# EAGLE schematic RAC-radio (EAGLE 9.5.2)
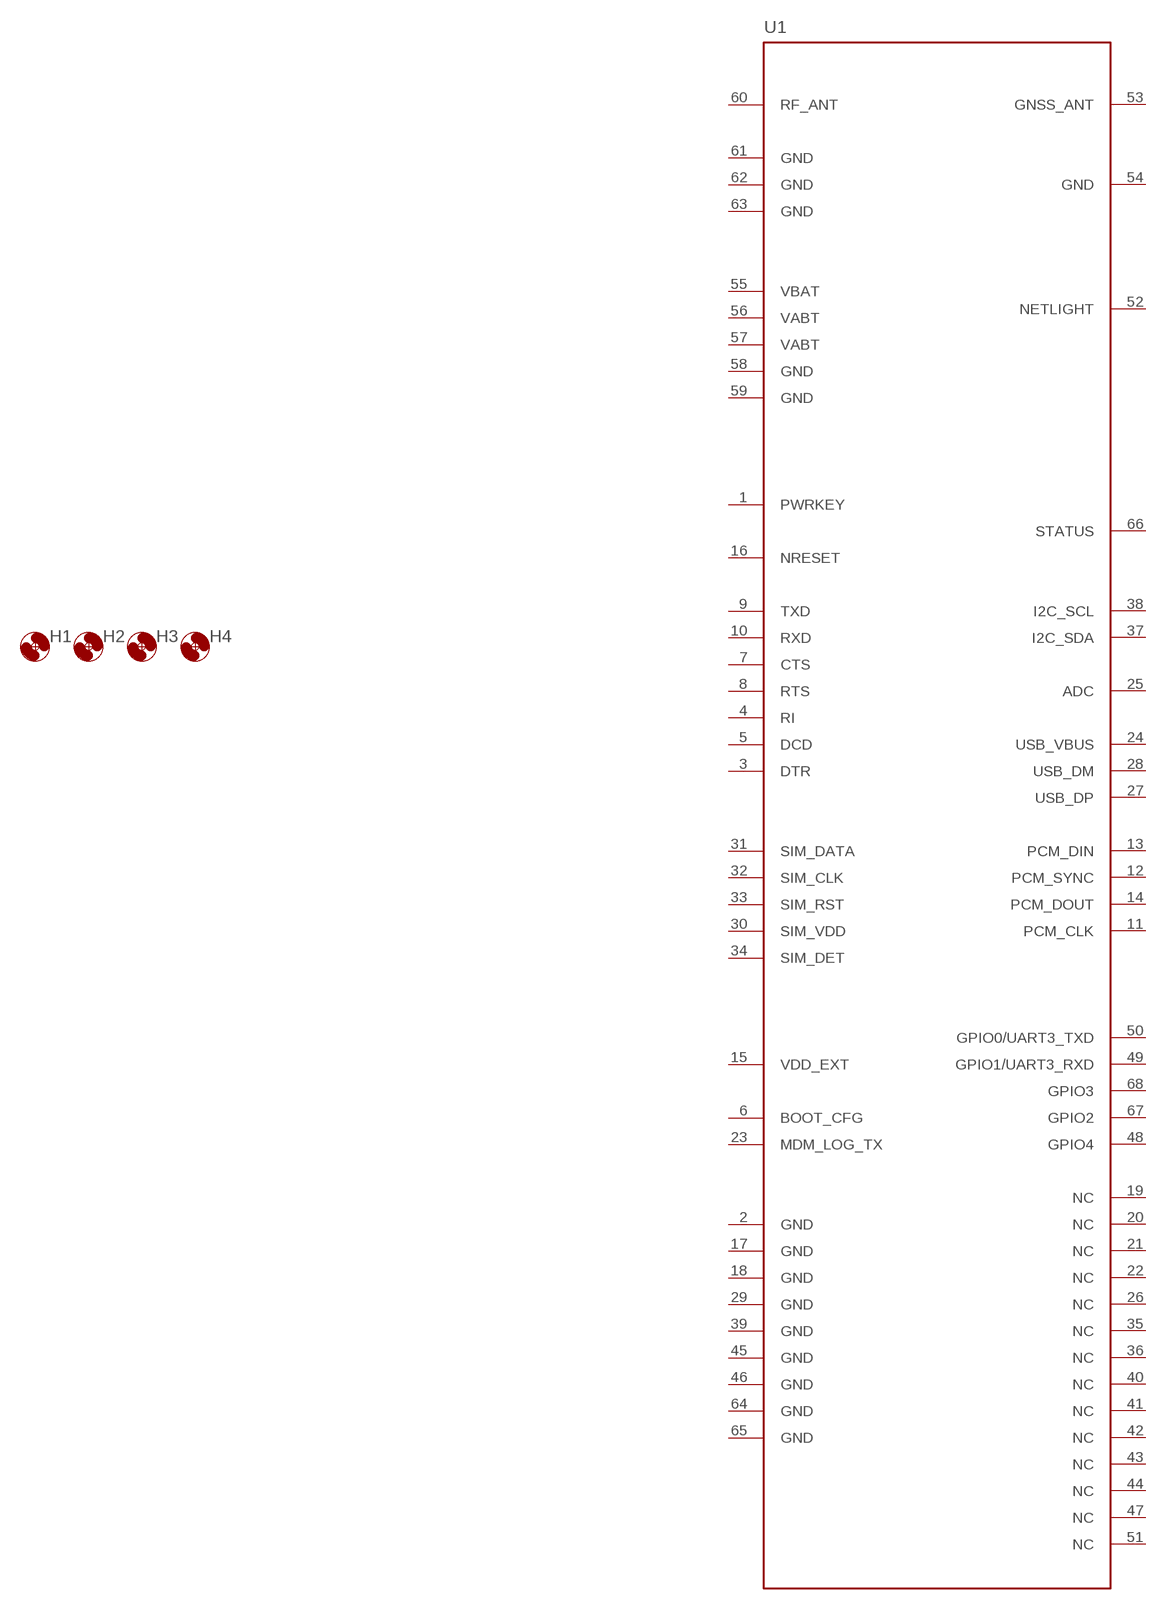
[diagram p0: schematic, sheet 1]

## Parts
H1  MOUNT-HOLE2.8  [2,8]
H2  MOUNT-HOLE2.8  [2,8]
H3  MOUNT-HOLE2.8  [2,8]
H4  MOUNT-HOLE2.8  [2,8]
U1  SIM7000  [SIM7000]
Unconnected: U1.1(PWRKEY) U1.2(GND) U1.3(DTR) U1.4(RI) U1.5(DCD) U1.6(BOOT_CFG) U1.7(CTS) U1.8(RTS) U1.9(TXD) U1.10(RXD) U1.11(PCM_CLK) U1.12(PCM_SYNC) U1.13(PCM_DIN) U1.14(PCM_DOUT) U1.15(VDD_EXT) U1.16(NRESET) U1.17(GND) U1.18(GND) U1.19(NC) U1.20(NC) U1.21(NC) U1.22(NC) U1.23(MDM_LOG_TX) U1.24(USB_VBUS) U1.25(ADC) U1.26(NC) U1.27(USB_DP) U1.28(USB_DM) U1.29(GND) U1.30(SIM_VDD) U1.31(SIM_DATA) U1.32(SIM_CLK) U1.33(SIM_RST) U1.34(SIM_DET) U1.35(NC) U1.36(NC) U1.37(I2C_SDA) U1.38(I2C_SCL) U1.39(GND) U1.40(NC) U1.41(NC) U1.42(NC) U1.43(NC) U1.44(NC) U1.45(GND) U1.46(GND) U1.47(NC) U1.48(GPIO4) U1.49(GPIO1/UART3_RXD) U1.50(GPIO0/UART3_TXD) U1.51(NC) U1.52(NETLIGHT) U1.53(GNSS_ANT) U1.54(GND) U1.55(VBAT) U1.56(VABT) U1.57(VABT) U1.58(GND) U1.59(GND) U1.60(RF_ANT) U1.61(GND) U1.62(GND) U1.63(GND) U1.64(GND) U1.65(GND) U1.66(STATUS) U1.67(GPIO2) U1.68(GPIO3)

## Library data of the parts
H1-H4 = holes:MOUNT-HOLE: MOUNTING HOLE with drill center marker
U1 = rocket-components:SIM7000